# Altium schematic sheet RS485.SchDoc
size A4
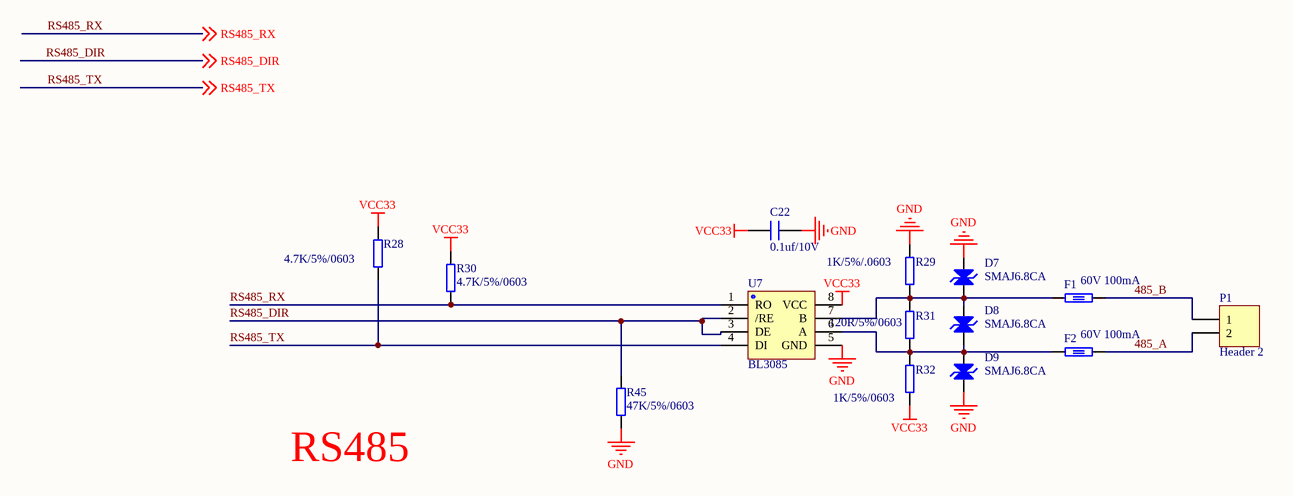
[diagram p0: RS485.SchDoc]

## Parts
C22  0.1uf/10V  [0603R]
D7  SMAJ6.8CA  [DO-214AC 双极性]
D8  SMAJ6.8CA  [DO-214AC 双极性]
D9  SMAJ6.8CA  [DO-214AC 双极性]
F1  60V 100mA  [R0603]
F2  60V 100mA  [R0603]
P1  Header 2  [CONN-TH_P5.08_KF127-5.08-2P]
R28  4.7K/5%/0603  [0603R]
R29  1K/5%/.0603  [0603R]
R30  4.7K/5%/0603  [0603R]
R31  120R/5%/0603  [0603R]
R32  1K/5%/0603  [0603R]
R45  47K/5%/0603  [0603R]
U7  BL3085  [SO8]

## Nets
GND: C22.2 D7.1(K) D9.2(A) R29.1 R45.2 U7.5(GND)
VCC33: C22.1 R28.2 R30.2 R32.2 U7.8(VCC)
485_A: F2.2 P1.2
485_B: F1.2 P1.1
RS485_DIR: R45.1 U7.2(/RE) U7.3(DE) ; off-sheet RS485_DIR
RS485_RX: R30.1 U7.1(RO) ; off-sheet RS485_RX
RS485_TX: R28.1 U7.4(DI) ; off-sheet RS485_TX
NetD7_2: D7.2(A) D8.1(K) F1.1 R29.2 R31.1 U7.7(B)
NetD8_2: D8.2(A) D9.1(K) F2.1 R31.2 R32.1 U7.6(A)

## Notes on the sheet
- RS485

## Library data of the parts
C22 = CAP
D7-D9 = TVS
F1 F2 = FUSE
P1 = Header 2: Header, 2-Pin; LatestRevisionDate: 17-Jul-2002; LatestRevisionNote: Re-released for DXP Platform.; Publisher: Altium Limited
R28-R32 R45 = RES
U7 = MAX485